# EAGLE design headstage-64-coax-adapter_rev1.1 (EAGLE 9.5.1)
DESIGNER: Jon Newman; DESIGN_NAME: Headstage-64 Coax Adapter; LICENSE: CERN OHL v1.2; REVISION: 1.0
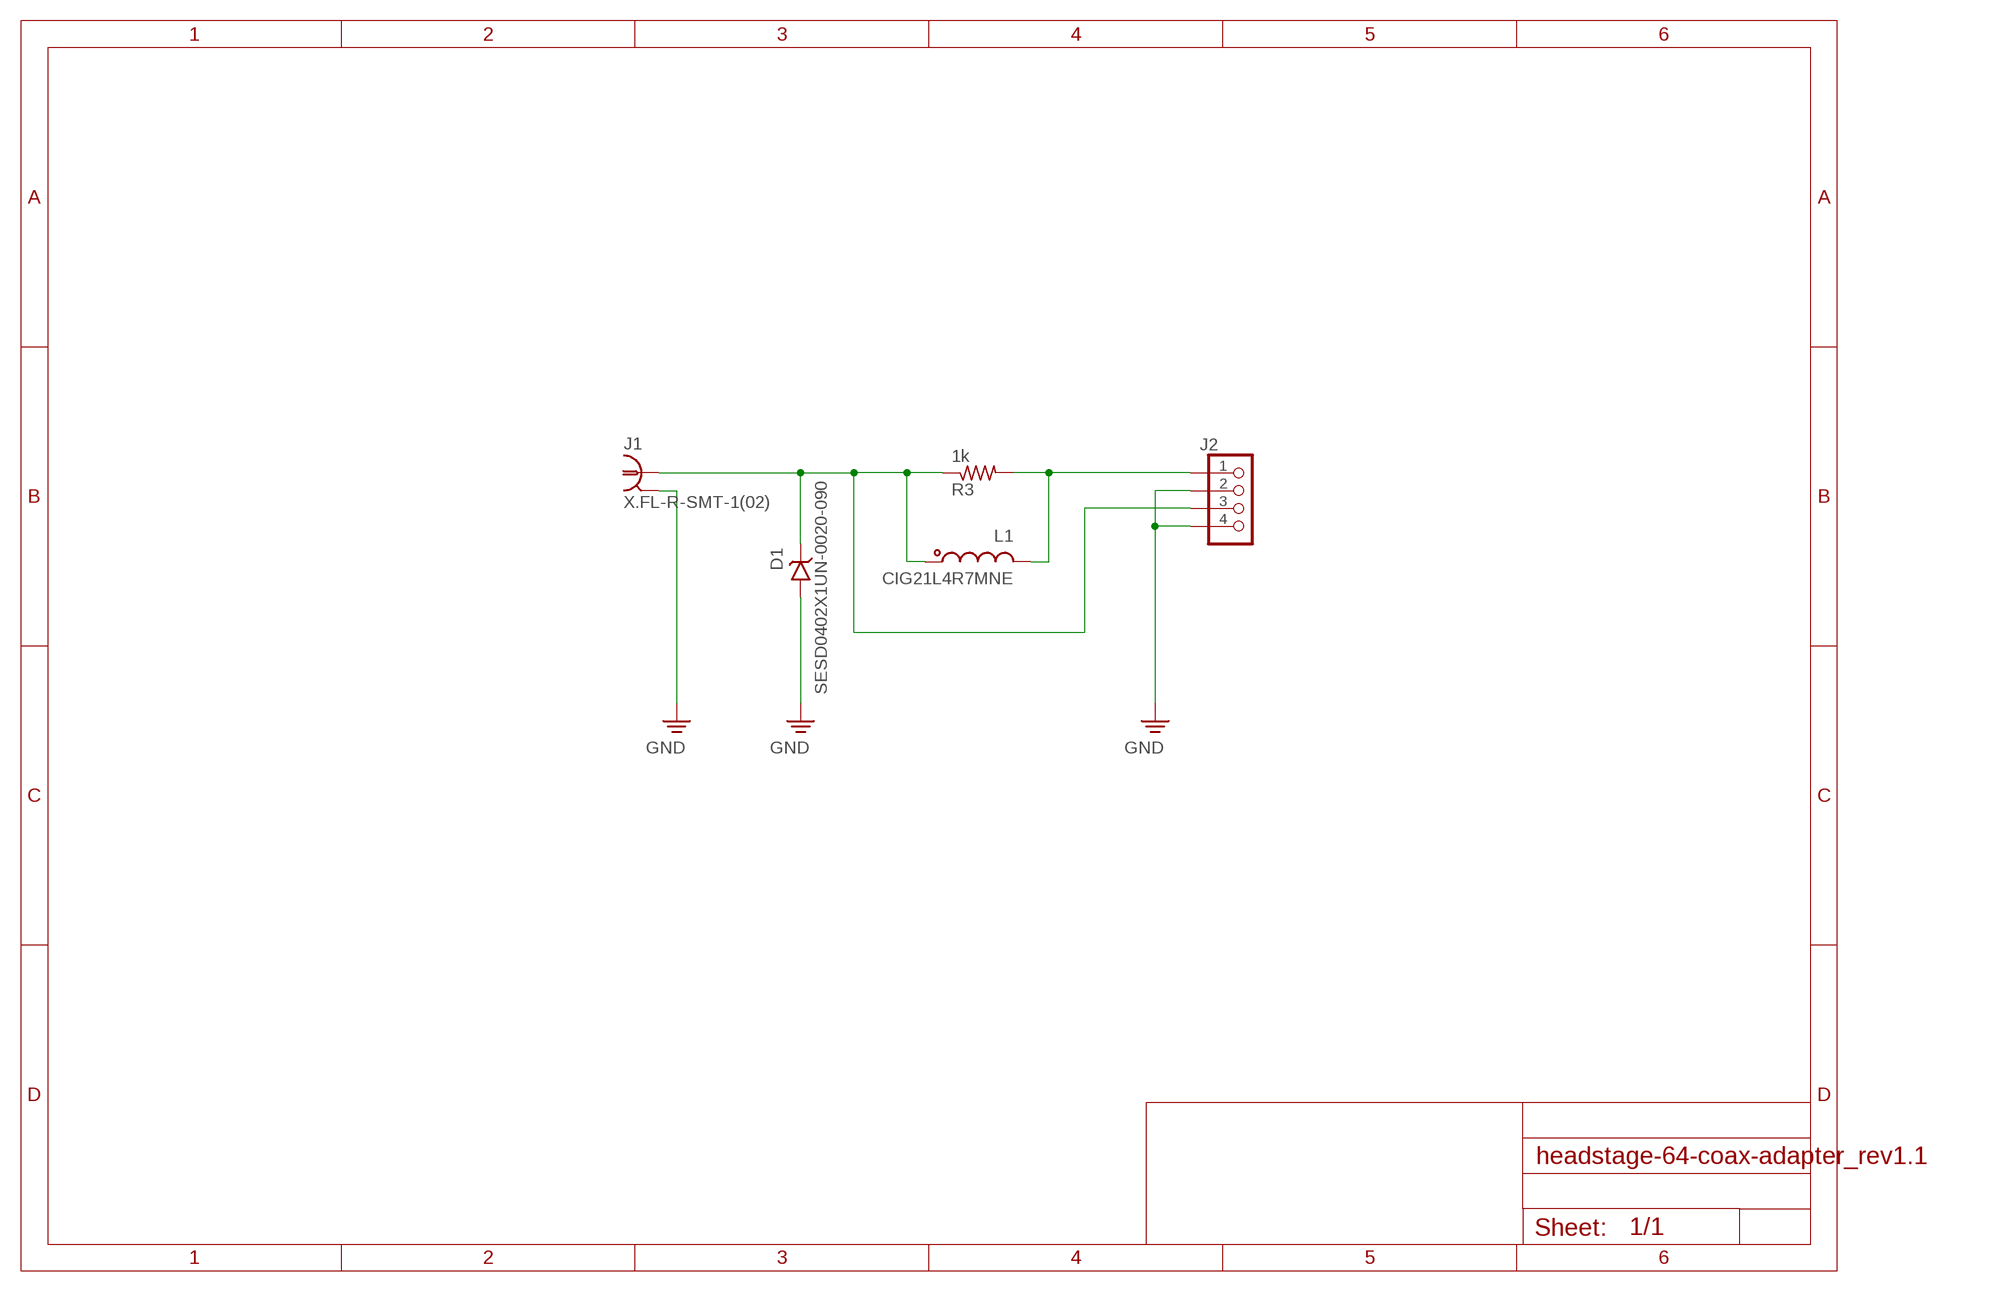
[diagram p0: schematic, sheet 1]

## Parts
D1  SESD0402X1UN-0020-090  Z-DIODE_0402T-DFN  [0402T-DFN]
J1  X.FL-R-SMT-1(02)  COAX_XFL  [X_FL_R_SMT_1(02)]
J2  PINHD-1X4HEADSTAGE64-DAUGHTER-CARD-CASTELLATED  [HEADSTAGE64-DAUGHER-CARD-CASTELLATED]
L1  CIG21L4R7MNE  L_0805T  [0805T]
R3  1k  R_0201T  [0201T]

## Nets
_SIGOUT1: D1.C J1.P$1 J2.3 L1.1 R3.1
GND: D1.A J1.P$2 J1.P$3 J1.P$4 J2.2 J2.4
N$48: J2.1 L1.2 R3.2

## Library data of the parts
D1 = jonnew:Z-DIODE: Zener Diode
J1 = jonnew:COAX: COAX CONNECTOR - Edge mount BNC - Vertical BNC - Vertical SMA - etc
J2 = jonnew:PINHD-1X4
L1 = jonnew:L: Inductor
R3 = jonnew:R: Resistor

## Board
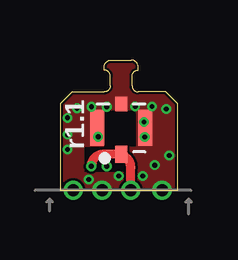
[diagram p1: board, top side]
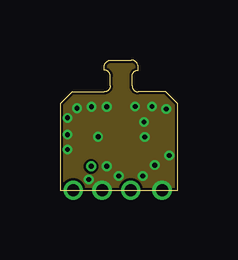
[diagram p2: board, inner layer Route2]
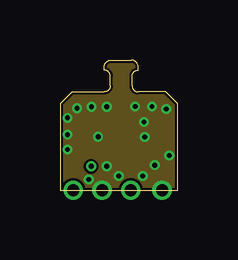
[diagram p3: board, inner layer Route15]
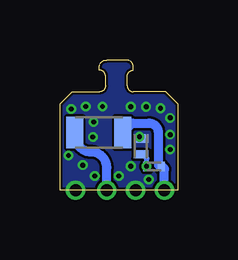
[diagram p4: board, bottom side, seen from below]

Size 4.9 x 5.43 mm. Coordinates in mm from the lower left corner, seen from the top.
Outline: 0,0 4.9,0 4.9,3.6 4.4,4.11 3.25,4.11 arc-90 3,4.36 3,4.75 arc-90 3.25,5 3.26,5 3.26,5.13 arc90 2.96,5.43 2.14,5.43 arc90 1.84,5.13 1.84,5 1.85,5 arc-90 2.1,4.75 2.1,4.36 arc-90 1.85,4.11 0.5,4.11 0,3.6 0,0
Copper layers (1*2*15*16): Top 0.035mm / dielectric 0.2mm / Route2 0.0175mm / dielectric 0.3mm / Route15 0.0175mm / dielectric 0.2mm / Bottom 0.035mm
Design rules "seeed-studio-4-layer *": minimum track width 4mil, minimum drill 0.2mm, track to track 4mil, track to pad 4mil, pad to pad 4mil, via to via 4mil, smd to smd 0mil, copper to edge 0.1mm, drill to drill 10mil, minimum pad ring 6mil, minimum via ring 4mil, stop-mask expansion 4mil, vias tented up to drill 100mil, thermal gap 10mil

### Footprints (pad centres in the part's own frame; a part is rotated, then mirrored left to right if it is on the bottom)
0402T-DFN = smd 0.35 x 0.6: A -0.325,0; C 0.325,0
X_FL_R_SMT_1(02) = smd 0.5 x 0.7: P$1 0,-1.1 | smd 0.6 x 1.5: P$2 -1,0; P$4 1,0 | smd 0.5 x 0.6: P$3 0,1
HEADSTAGE64-DAUGHER-CARD-CASTELLATED = drill 0.5: 1 -2.4,0; 2 -1.2,0; 3 0,0; 4 1.3,0
0805T = smd 0.7 x 1.3: 1 -1,0; 2 1,0
0201T = smd 0.3 x 0.4: 1 -0.3,0; 2 0.3,0

### Placement (x,y rotation side)
D1  1.53,1.83 270 bottom
J1  2.55,2.6 0 top
J2  2.95,0 0 top
L1  3.28,2.41 0 bottom
R3  0.98,0.99 0 bottom

### Tracks (layer width: path | path; a pad name or v marks a point on that pad's centre or on a via)
_SIGOUT1  (via drill 0.2)
  Top 0.37: J2.3 2.95,0.95 arc90 2.4,1.5 J1.P$1 1.8,1.5 arc90 v1.3,1
  Bottom 0.127: R3.1 R3.1 arc90 v1.3,1
  Bottom 0.2: R3.1 1.28,1.33 D1.C
  Bottom 0.37: 4.28,2.21 L1.1 4.28,2.28 arc-90 3.6,1.6 arc90 2.95,0.95 J2.3
GND  (via drill 0.2)
  Top 0.4: J2.2 1.9,0.15
  other vias: 1.59,2.23 2.45,0.6 0.31,2.32 0.31,1.7 3.53,2.22 1.95,3.48 1.31,3.48 3.95,1.05 3.45,0.6 3.5,2.85 3.13,3.49 0.31,3.02 0.71,3.42 4.43,3.39 1.95,1 1.2,0.45 4.55,1.45 3.83,3.49
  pour Bottom (isolate 0.02, rank 2, no thermals): 0,6.34 4.9,6.34 4.9,0 0,0
  pour Route15 (isolate 0.02, rank 2, no thermals): 0,6.34 4.9,6.34 4.9,0 0,0
  pour Top (isolate 0.02, rank 2, no thermals): 0,6.34 4.9,6.34 4.9,0 0,0
  pour Route15 (isolate 0.02, rank 2, no thermals): 0,6.34 4.9,6.34 4.9,0 0,0
  pour Route2 (isolate 0.02, rank 2, no thermals): 0,6.34 4.9,6.34 4.9,0 0,0
N$48
  Bottom 0.37: L1.2 1.89,2.8 1.2,2.8 arc90 0.8,2.4 0.8,1.11 arc-90 R3.2 arc90 0.55,0.86 J2.1
N$49
  cutout Top: 2.7,0.78 1.04,0.78 1.04,1.8 2.35,1.8 2.7,1.09

### Text on the board
tPlace: r1.1